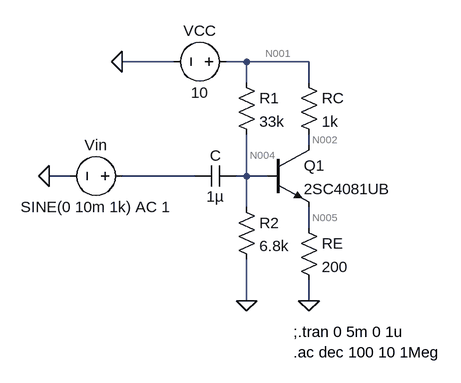
[diagram p0: schematic lab2_task4.asc]
lab2_task4.asc, the LTspice schematic file:
Version 4.1
SHEET 1 880 680
WIRE 16 112 -64 112
WIRE 128 112 96 112
WIRE 224 112 128 112
WIRE 128 144 128 112
WIRE 224 144 224 112
WIRE 224 240 224 224
WIRE -144 288 -176 288
WIRE 48 288 -64 288
WIRE 128 288 128 224
WIRE 128 288 112 288
WIRE 160 288 128 288
WIRE 128 336 128 288
WIRE 224 368 224 336
WIRE 128 480 128 416
WIRE 224 480 224 448
FLAG -64 112 0
FLAG 224 480 0
FLAG 128 480 0
FLAG -176 288 0
SYMBOL voltage 112 112 R90
WINDOW 0 -32 56 VBottom 2
WINDOW 3 32 56 VTop 2
SYMATTR InstName VCC
SYMATTR Value 10
SYMBOL npn 160 240 R0
SYMATTR InstName Q1
SYMATTR Value 2SC4081UB
SYMBOL res 208 128 R0
SYMATTR InstName RC
SYMATTR Value 1k
SYMBOL res 208 352 R0
SYMATTR InstName RE
SYMATTR Value 200
SYMBOL res 112 128 R0
SYMATTR InstName R1
SYMATTR Value 33k
SYMBOL res 112 320 R0
SYMATTR InstName R2
SYMATTR Value 6.8k
SYMBOL voltage -48 288 R90
WINDOW 0 -32 56 VBottom 2
WINDOW 3 32 56 VTop 2
SYMATTR InstName Vin
SYMATTR Value SINE(0 10m 1k) AC 1
SYMBOL cap 112 272 R90
WINDOW 0 0 32 VBottom 2
WINDOW 3 32 32 VTop 2
SYMATTR InstName C
SYMATTR Value 1µ
TEXT 200 528 Left 2 !;.tran 0 5m 0 1u\n.ac dec 100 10 1Meg

The netlist it stands for:
* lab2_task4.asc
VCC N001 0 10
Q1 N002 N004 N005 0 2SC4081UB
RC N001 N002 1k
RE N005 0 200
R1 N001 N004 33k
R2 N004 0 6.8k
Vin N003 0 SINE(0 10m 1k) AC 1
C N004 N003 1µ
.model NPN NPN
.model PNP PNP
.lib standard.bjt
;.tran 0 5m 0 1u
.ac dec 100 10 1Meg
.backanno
.end

* Results of the author's LTspice run, read from the files saved beside the schematic
* Operating Point, zero values left out:
*   V(n001) = 10 V
*   V(n002) = 5.187 V
*   V(n004) = 1.612 V
*   V(n005) = 966 mV
*   Ic(Q1) = 4.813 mA
*   Ib(Q1) = 17.1 µA
*   Ie(Q1) = -4.83 mA
*   I(R2) = 237.1 µA
*   I(R1) = 254.2 µA
*   I(Re) = 4.83 mA
*   I(Rc) = 4.813 mA
*   I(Vcc) = -5.067 mA
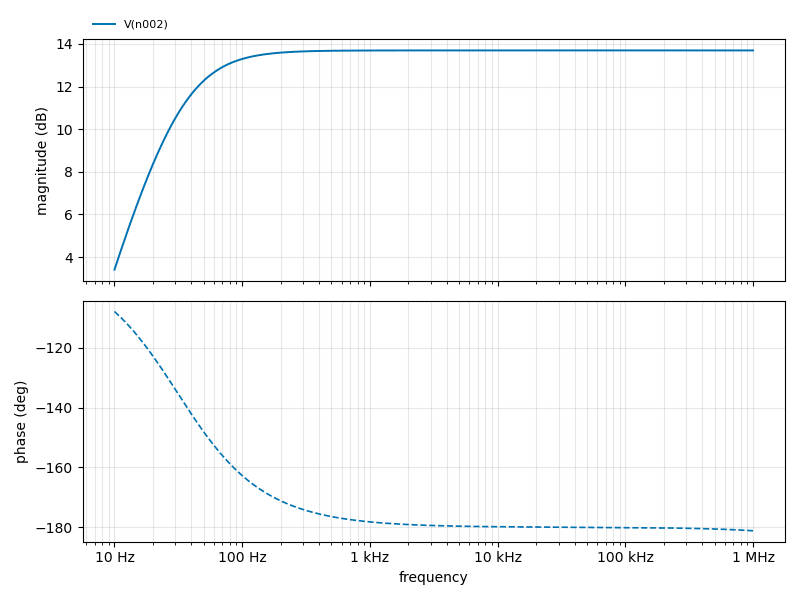
[diagram p1: AC Analysis of lab2_task4.asc, plotted from the saved traces]
* AC Analysis, 1 run:
*   V(n002): 3.41 dB at 10 Hz, 13.69 dB at 1 MHz, peak 13.69 dB at 45.71 kHz, 3 dB below the peak at 31.12 Hz